# EAGLE design light_switch_hi_volt (EAGLE 7.2.0)
CNAME: Light controller; CREVISION: 1.2; DESIGNER: iGrowing
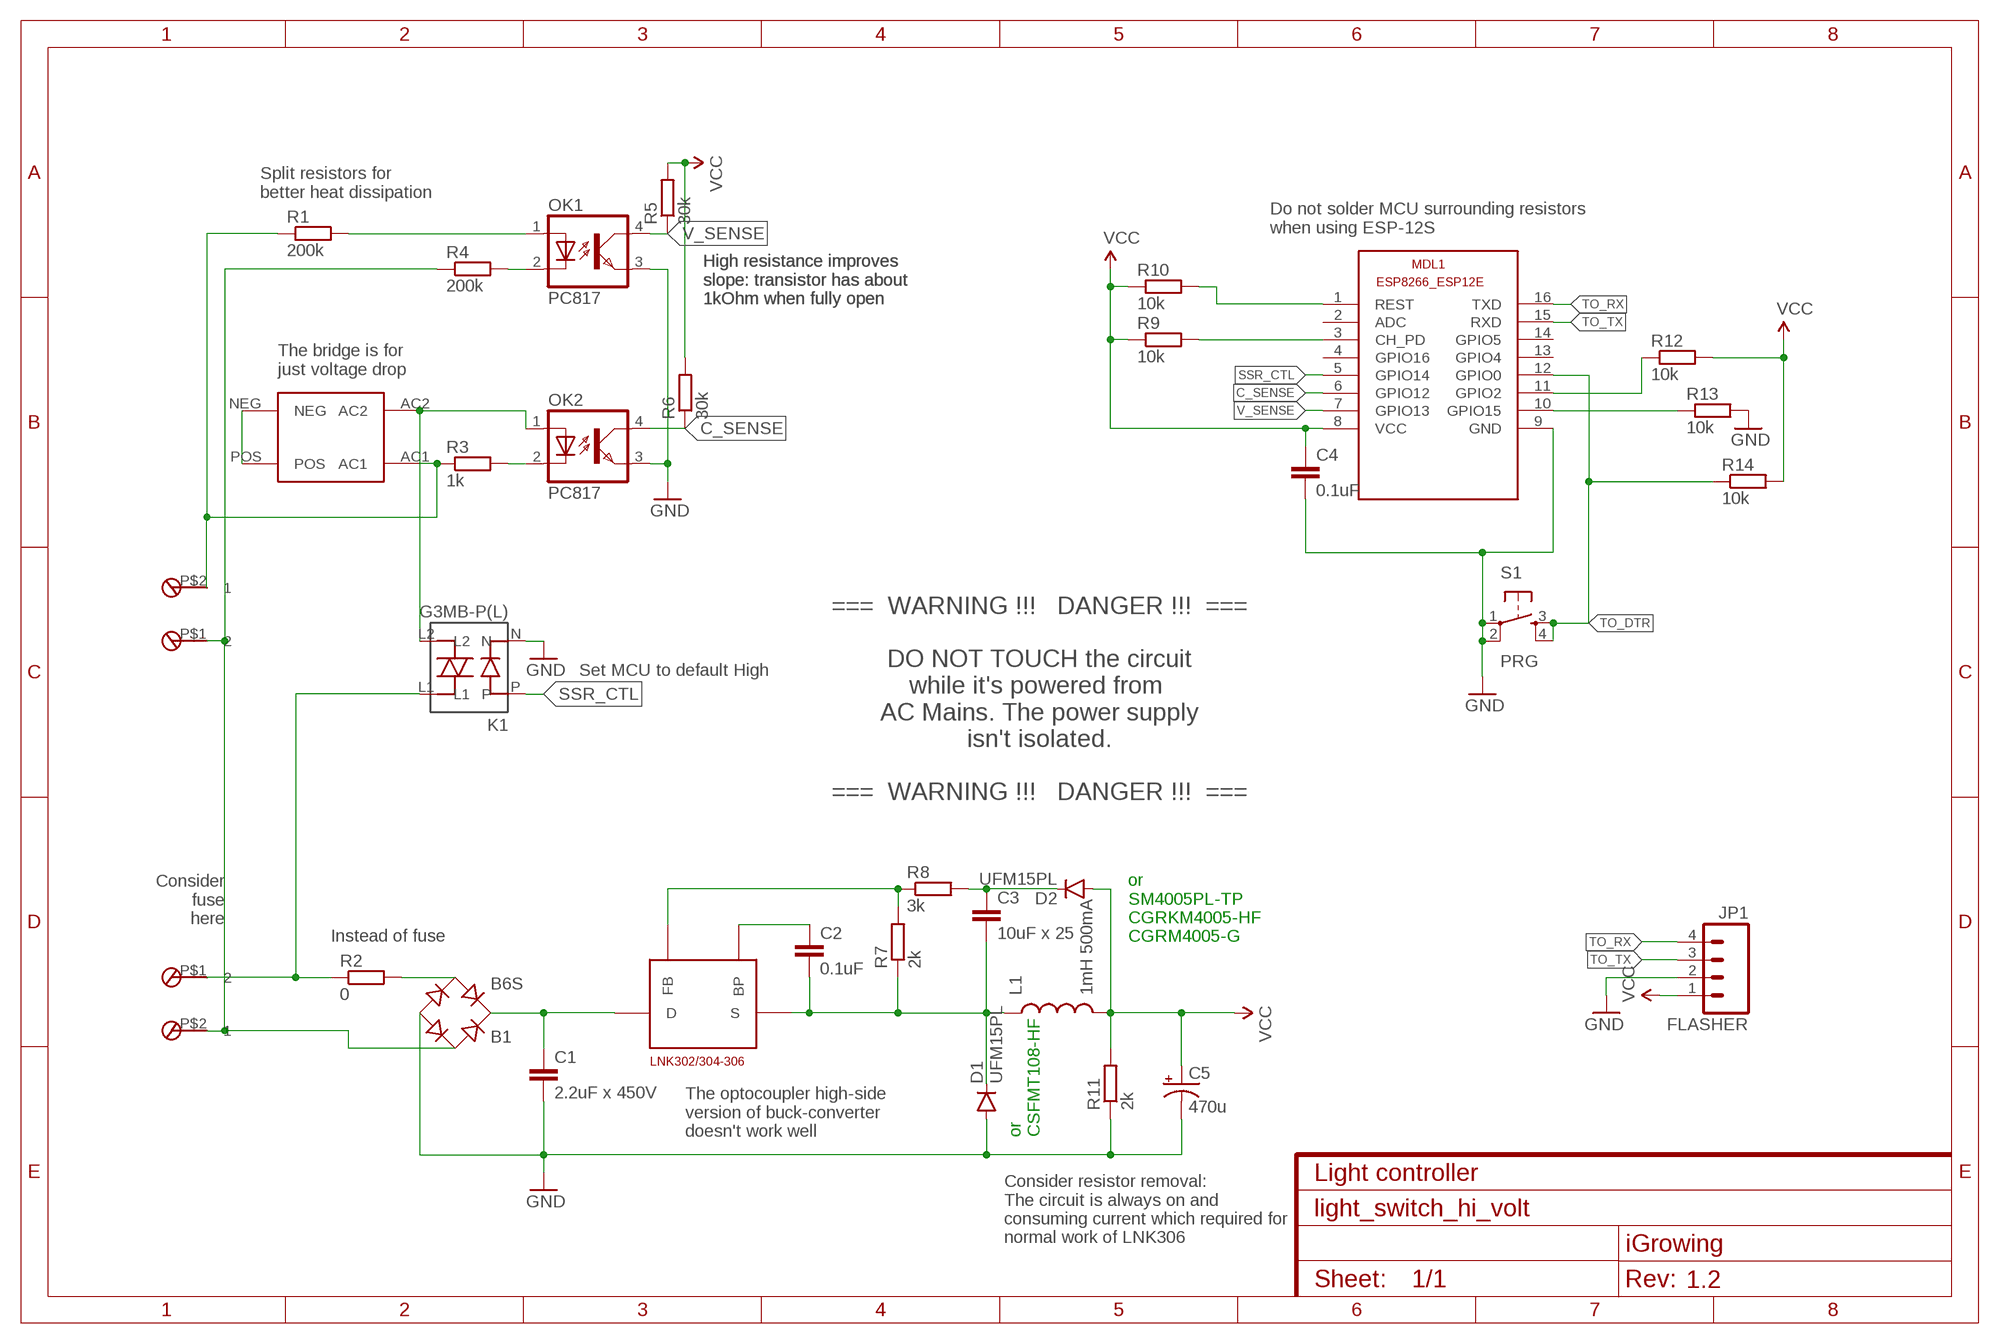
[diagram p0: schematic, sheet 1]

## Parts
B1  B6S  [MBS]
C1  2.2uF x 450V  C-EUC2220K  [C2220K]
C2  0.1uF  CAP0805  [0805]
C3  10uF x 25  CAP0805  [0805]
C4  0.1uF  CAP0805  [0805]
C5  470u  CAP_POL7343  [EIA7343]
D1  UFM15PL  DIODESOD123  [SOD-123]
D2  UFM15PL  DIODESOD123  [SOD-123]
J1  2POS_TERM_BLK_10A_3.5MM  [2POS_TERM_BLK_10A_3.5MM]
J2  2POS_TERM_BLK_10A_3.5MM  [2POS_TERM_BLK_10A_3.5MM]
JP1  FLASHER  M04PTH  [1X04]
K1  G3MB-P(L)  G3MB  [GB3M_SSR]
L1  1mH 500mA  INDUCTORPWR  [CDRH125]
MDL1  ESP8266-12EESP8266-ESP12E  [ESP8266-ESP12E]
OK1  PC817  LTV816S  [SMD4]
OK2  PC817  LTV816S  [SMD4]
R1  200k  R-EU_R0805  [R0805]
R2  0  R-EU_R0603  [R0603]
R3  1k  R-EU_R0603  [R0603]
R4  200k  R-EU_R0805  [R0805]
R5  30k  R-EU_R0603  [R0603]
R6  30k  R-EU_R0603  [R0603]
R7  2k  R-EU_R0603  [R0603]
R8  3k  R-EU_R0603  [R0603]
R9  10k  R-EU_R0603  [R0603]
R10  10k  R-EU_R0603  [R0603]
R11  2k  R-EU_R0603  [R0603]
R12  10k  R-EU_R0603  [R0603]
R13  10k  R-EU_R0603  [R0603]
R14  10k  R-EU_R0603  [R0603]
S1  PRG  TAC_SWITCHSMD  [TACTILE-SWITCH-SMD]
U1  Z4DGP406L-HF  [Z4DGP406L-HF]
U2  LNK306  [SO08]

## Nets
C_SENSE: MDL1.6(GPIO12) OK2.4(COL) R6.1
GND: B1.- C1.2 C4.2 C5.C(-) D1.A JP1.2 K1.N MDL1.9(GND) OK1.3(EMIT) OK2.3(EMIT) R11.1 R13.2 S1.1 S1.2
IO2: MDL1.11(GPIO2) R12.1
IO15: MDL1.10(GPIO15) R13.1
N$1: B1.+ C1.1 U2.4(D)
N$2: J2.P$1 K1.L1 R2.1
N$3: OK1.1(A) R1.2
N$4: B1.AC1 J1.P$1 J2.P$2 R4.1
N$5: U1.NEG U1.POS
N$6: B1.AC2 R2.2
N$7: K1.L2 OK2.1(A) U1.AC2
N$8: J1.P$2 R1.1 R3.1 U1.AC1
N$9: OK2.2(C) R3.2
N$10: OK1.2(C) R4.2
N$15: MDL1.3(CH_PD) R9.2
N$30: C2.1 U2.1(BP)
N$31: C2.2 C3.2 D1.C L1.1 R7.1 U2.5(S) U2.6(S) U2.7(S) U2.8(S)
N$32: R7.2 R8.1 U2.2(FB)
N$33: C3.1 D2.C R8.2
SSR_CTL: K1.P MDL1.5(GPIO14)
TO_DTR: MDL1.12(GPIO0) R14.1 S1.3 S1.4
TO_RTS: MDL1.1(REST) R10.2
TO_RX: JP1.4 MDL1.16(TXD)
TO_TX: JP1.3 MDL1.15(RXD)
V_SENSE: MDL1.7(GPIO13) OK1.4(COL) R5.1
VCC: C4.1 C5.A(+) D2.A JP1.1 L1.2 MDL1.8(VCC) R5.2 R6.2 R9.1 R10.1 R11.2 R12.2 R14.2
Unconnected: MDL1.2(ADC) MDL1.4(GPIO16) MDL1.13(GPIO4) MDL1.14(GPIO5)

## Notes on the sheet
- Split resistors for
  better heat dissipation
- Do not solder MCU surrounding resistors
  when using ESP-12S
- High resistance improves
  slope: transistor has about
  1kOhm when fully open
- High resistance improves
  slope: transistor has about
  1kOhm when fully open
- The bridge is for
  just voltage drop
- Set MCU to default High
- ===  WARNING !!!   DANGER !!!  ===
  
  DO NOT TOUCH the circuit
  while it's powered from 
  AC Mains. The power supply
  isn't isolated.
  
  ===  WARNING !!!   DANGER !!!  ===
- Consider
  fuse
  here
- Instead of fuse
- or
  SM4005PL-TP
  CGRKM4005-HF
  CGRM4005-G
- The optocoupler high-side
  version of buck-converter
  doesn't work well
- or
  CSFMT108-HF
- Consider resistor removal:
  The circuit is always on and
  consuming current which required for
  normal work of LNK306

## Library data of the parts
B1 = rectifier:B*S: Surface Mount Glass Passivated Bridge Rectifiers Source: Comchip Bridge Rectifiers B05S-G_B10S-G.pdf
C1 = rcl:C-EU: CAPACITOR, European symbol; MPN: CKG57NX7T2W225M500JH; OC_NEWARK: 53W0109
C2 C4 = SparkFun-Capacitors:CAP: Capacitor Standard 0603 ceramic capacitor, and 0.1" leaded capacitor.; MF: Taiyo Yuden (U.S.A.), Inc.; MPN: TMK107BJ104KA-T; OC_NEWARK: 86H5300
C3 = SparkFun-Passives:CAP: Capacitor Standard 0603 ceramic capacitor, and 0.1" leaded capacitor.; MPN: GRM219R61E106KA12D; OC_NEWARK: 68X2791
C5 = SparkFun-Capacitors:CAP_POL: Capacitor Polarized These are standard SMD and PTH capacitors. Normally 10uF, 47uF, and 100uF in electrolytic and tantalum varieties. Always verify the external diameter of the through hole cap, it varies with capacity, voltage, and manufacturer. The EIA devices should be standard.
D1 D2 = SparkFun-DiscreteSemi:DIODE: Diode These are standard reverse protection diodes and small signal diodes. SMA package can handle up to about 1A. SOD-323 can handle about 200mA. What the SOD-323 package when ordering, there are some mfgs out there that are 5-pin packages.; MPN: UFM15PL-TP; OC_NEWARK: 69R6525
J1 J2 = bismart:2POS_TERM_BLK_10A_3.5MM; OC_NEWARK: unknown
JP1 = SparkFun-Connectors:M04: Header 4 Standard 4-pin 0.1" header. Use with straight break away headers (SKU : PRT-00116), right angle break away headers (PRT-00553), swiss pins (PRT-00743), machine pins (PRT-00117), and female headers (PRT-00115). Molex polarized connector foot print use with SKU : PRT-08231 with associated crimp pins and housings. 1MM SMD Version SKU: PRT-10208
K1 = bismart:G3MB: Omron G3MB SSR. G3MB-202P 5V control. Up to 240VAC 2A controlled.
L1 = SparkFun-Passives:INDUCTOR: Inductors Basic Inductor/Choke - 0603 and 1206. Footprints are not proven and vary greatly between part numbers. SRN6045- 33uH, 20% 1.4A SDR0403-560KL - 56uH, 10%, 500mA RMS/740mA peak; MPN: 46105C; OC_NEWARK: 12N1335
MDL1 = ESP8266-ESP12E:ESP8266-12E: ESP8266-12E with additional I/O and GPIO04/05 corrected The author cannot warrant that this library is free from error or will meet your specific requirements. Created by PuceBaboon.com. Komagane, Nagano, JAPAN
OK1 OK2 = optocoupler:LTV816: OPTO COUPLER Source: LITEON, LTV816.pdf; OC_FARNELL: unknown; OC_NEWARK: unknown
R1-R8 R11 = resistor:R-EU_: RESISTOR, European symbol; MF: VISHAY/DALE; MPN: CRCW06032K00FKEA; OC_NEWARK: 52K8223
R9 R10 R12-R14 = rcl:R-EU_: RESISTOR, European symbol
S1 = SparkFun-Retired:TAC_SWITCH: Momentary Switch Button commonly used for reset or general input. Spark Fun Electronics SKU : COM-00097 SMT- SWCH-08247; PROD_ID: SWCH-08247; VALUE: TAC_SWITCHSMD
U1 = bismart:Z4DGP406L-HF; OC_NEWARK: unknown
U2 = bismart:LNK30: Lowest Component Count, Energy-Efficient Off-Line Switcher IC LNK302, LNK304, LNK305, LKN306 Product Highlights Cost Effective Linear/Cap Dropper Replacement; MPN: LNK306GN; OC_FRANELL: 1448228; OC_NEWARK: unknown; PACKAGE: SMD-8; SUPPLIER: POWER INTEGRATIONS

## Board
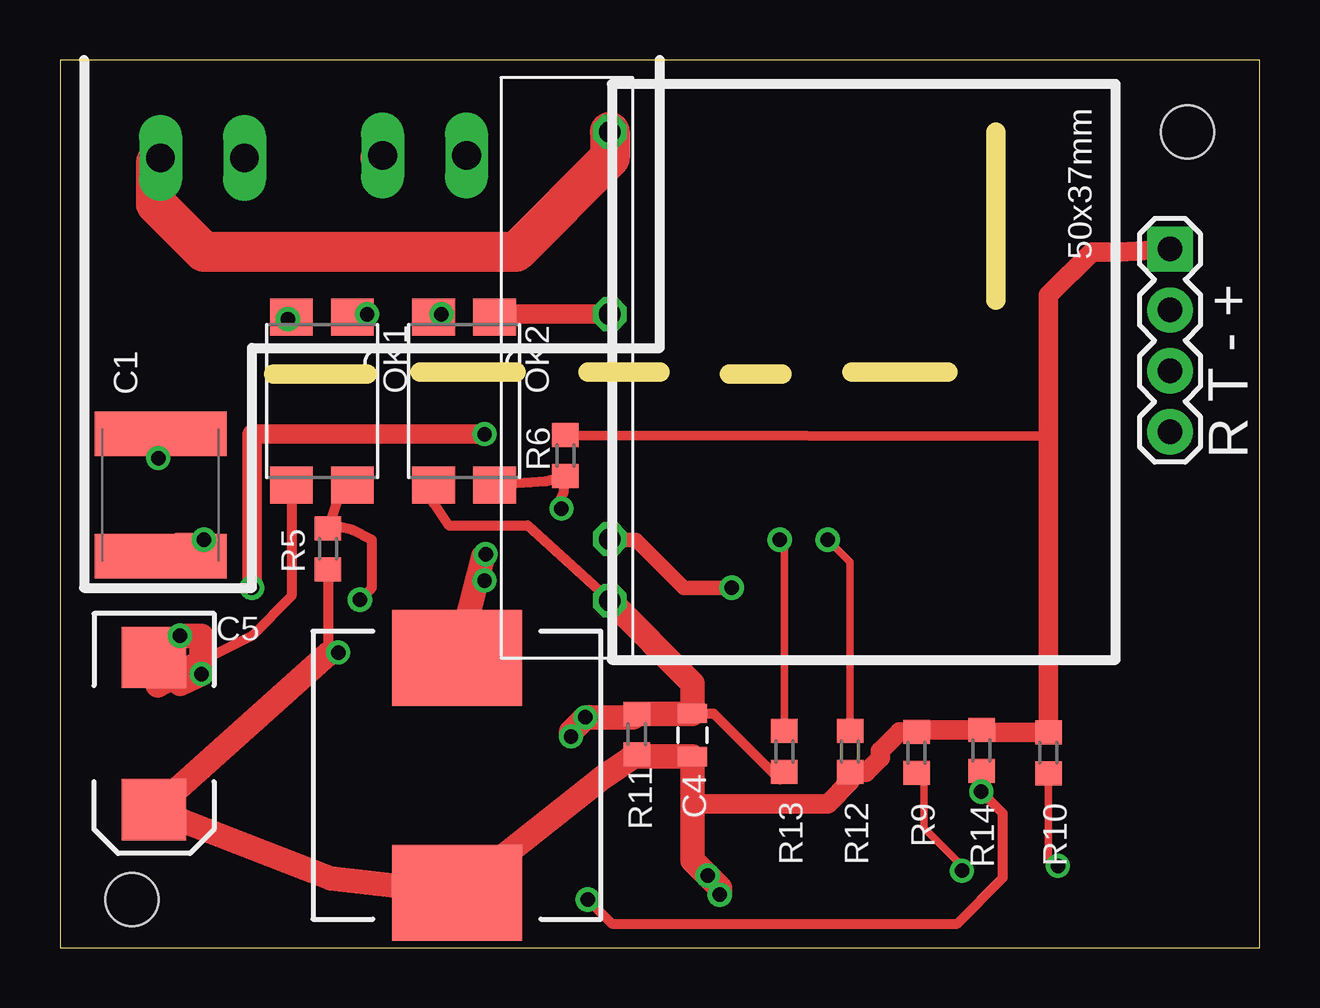
[diagram p1: board, top side]
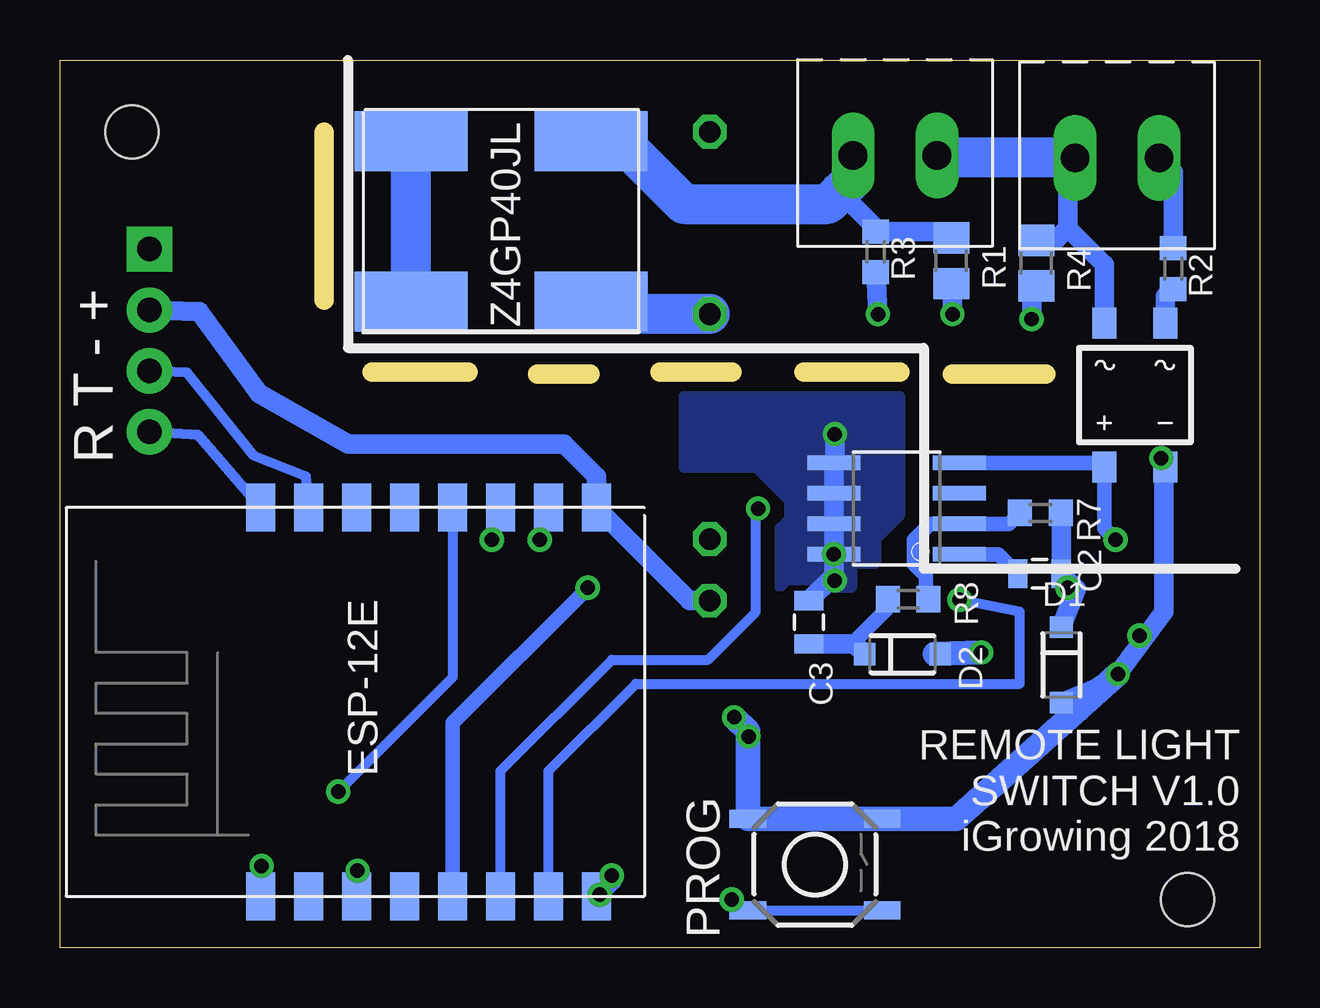
[diagram p2: board, bottom side, seen from below]

Size 50 x 37 mm. Coordinates in mm from the lower left corner, seen from the top.
Outline: 0,0 50,0 50,37 0,37 0,0
Copper layers (1*16): Top 0.035mm / dielectric 1.5mm / Bottom 0.035mm
Design rules "default *": minimum track width 10mil, minimum drill 20mil, track to track 8mil, track to pad 8mil, pad to pad 8mil, via to via 8mil, smd to smd 8mil, copper to edge 40mil, drill to drill 8mil, minimum pad ring 10mil, minimum via ring 8mil, stop-mask expansion 4mil, vias tented up to drill 25mil, thermal gap 10mil
Holes 2.2 mm at 47,34 3,2
Milling: 6 lines

### Footprints (pad centres in the part's own frame; a part is rotated, then mirrored left to right if it is on the bottom)
MBS = smd 1 x 1.3: + -1.27,-3; - 1.27,-3; AC1 -1.27,3; AC2 1.27,3
C2220K = smd 1.85 x 5.5: 1 -2.55,0; 2 2.55,0
0805 = smd 0.8 x 1.2: 1 -0.9,0; 2 0.9,0
EIA7343 = smd 2.55 x 2.7: A 3.17,0; C -3.17,0
SOD-123 = smd 0.9 x 0.95: A 1.575,0; C -1.575,0
2POS_TERM_BLK_10A_3.5MM = drill 1.2 long: P$1 0,2; P$2 0,-1.5
1X04 = drill 1.016 pad 1.88 square: 1 0,0 | drill 1.016 pad 1.88: 2 2.54,0; 3 5.08,0; 4 7.62,0
GB3M_SSR = drill 0.9 octagon: L1 15.928,-2.54; L2 8.328,-2.54; N -3.619,-2.54; P -1.052,-2.54
CDRH125 = smd 5.4 x 4: 1 0,4.9; 2 0,-4.9
ESP8266-ESP12E = smd 2 x 1.2: 1 0,16; 2 0,14; 3 0,12; 4 0,10; 5 0,8; 6 0,6; 7 0,4; 8 0,2; 9 16.2,2; 10 16.2,4; 11 16.2,6; 12 16.2,8; 13 16.2,10; 14 16.2,12; 15 16.2,14; 16 16.2,16
SMD4 = smd 1.78 x 1.55: 1 -1.27,-3.5; 2 1.27,-3.5; 3 1.27,3.5; 4 -1.27,3.5
R0805 = smd 1.3 x 1.5: 1 -0.95,0; 2 0.95,0
R0603 = smd 1 x 1.1: 1 -0.85,0; 2 0.85,0
TACTILE-SWITCH-SMD = smd 1.524 x 0.762: 1 -2.794,1.905; 2 2.794,1.905; 3 -2.794,-1.905; 4 2.794,-1.905
Z4DGP406L-HF = smd 2.5 x 4.7: AC1 1.3,-2; AC2 8,-2; NEG 8,-9.5; POS 1.3,-9.5
SO08 = smd 0.61 x 2.21: 1 -1.905,-2.616; 2 -0.635,-2.616; 3 0.635,-2.616; 4 1.905,-2.616; 5 1.905,2.616; 6 0.635,2.616; 7 -0.635,2.616; 8 -1.905,2.616

### Placement (x,y rotation side)
B1  5.19,23.03 0 bottom
C1  4.19,18.86 90 top
C2  9.17,15.58 0 bottom
C3  18.78,13.56 90 bottom
C4  26.37,8.86 90 top
C5  3.92,8.92 270 top
D1  8.26,11.78 270 bottom
D2  14.88,12.23 0 bottom
J1  15.45,33.02 270 bottom
J2  6.19,32.92 270 bottom
JP1  46.27,29.12 270 top
K1  20.38,18.08 90 top
L1  16.55,7.18 0 top
MDL1  25.64,2.14 90 bottom
OK1  10.92,22.78 180 top
OK2  16.84,22.78 180 top
R1  12.85,28.63 270 bottom
R2  3.6,28.3 270 bottom
R3  30R  [R0603]  16,29 270 bottom
R4  9.31,28.53 270 bottom
R5  11.17,16.62 270 top
R6  21.07,20.51 90 top
R7  9.14,18.12 180 bottom
R8  14.65,14.52 180 bottom
R9  35.7,8.13 270 top
R10  41.2,8.12 270 top
R11  24.04,8.9 270 top
R12  32.93,8.18 270 top
R13  30.19,8.18 270 top
R14  38.41,8.22 90 top
S1  18.53,3.46 0 bottom
U1  25.87,34.92 270 bottom
U2  15.13,18.3 90 bottom

### Tracks (layer width: path | path; a pad name or v marks a point on that pad's centre or on a via)
C_SENSE  (via drill 0.6)
  Top 0.406: OK2.4 20.26,19.43 R6.1 21,19.17 21,19 20.7,18.3 v20.9,18.3
  Bottom 0.406: MDL1.6 31.64,7.36 27,12 23,12 21,14 21,18.2 v20.9,18.3
GND  (via drill 0.6)
  Top 0.406: C4.2 27.24,9.76 30,7 30,7.14 R13.2 | OK1.3 9.65,14.65 8,13 6,12 | OK2.3 15.57,18.53 16.2,17.6 19.48,17.6 K1.N
  Top 0.61: v4.1,20.4 4.1,21.32 C1.2
  Top 0.813: C4.2 | C5.C 4.08,10.92 | 6,12 5,11 | 23.89,9.6 R11.1
  Top 1.016: C4.2 26.37,11.01 K1.N | R11.1 C4.2 | 4.08,10.92 6,12 | 5,11 v5.9,11.4 5.9,13 v5,13 | 23.89,9.6 v21.9,9.6 21.3,9 v21.3,8.8
  Bottom 0.61: B1.- 3.92,20.22 v4.1,20.4
  Bottom 0.813: K1.N 23.76,14.46 MDL1.9 27.64,19.64 29,21 38,21 41.7,23.1 44.2,26.51 JP1.2 | S1.1 S1.2 | B1.- 4,19.95 4,14 v5.9,11.4 6.79,10.79 D1.A
  Bottom 1.016: v5.9,11.4 12.63,5.37 S1.1 21.32,9.02 v21.9,9.6
  pour Top (isolate 40): 0,17 0,8 8,0 42,0 42,23 25,23 25,19 22,19 22,14 6,14 3,14
  pour Bottom (isolate 40): 1,16 13,21 13,18 19,12 20,12 22,14 22,19 25,19 25,23 42,23 42,0 8,0 1,7
IO2  (via drill 0.6)
  Top 0.305: R12.1 32.93,16.07 v32,17
  Bottom 0.305: v32,17 32,17.98 MDL1.11
IO15  (via drill 0.6)
  Top 0.305: R13.1 30.19,16.81 v30,17
  Bottom 0.305: v30,17 30,17.98 MDL1.10
N$1  (via drill 0.6)
  Top 0.61: v6,17 4.88,17 C1.1
  Bottom 0.61: v6,17 6.46,17.46 B1.+ 6.63,20.2 U2.4
N$2
  Top 1.676: K1.L1 22.92,32.92 19,29 6,29 4,31 4,32.73 J2.P$1
  Bottom 0.813: R2.1 3.6,32.33 J2.P$1
N$3  (via drill 0.6)
  Top 0.813: OK1.1 12.68,26.28 v12.8,26.4
  Bottom 0.813: v12.8,26.4 12.8,27.63 R1.2
N$4  (via drill 0.6)
  Top 1.676: v13.35,32.92 J1.P$1
  Bottom 0.813: B1.AC1 6.46,28.46 8,30 | 8,30 8,32.61 J2.P$2 | R4.1 8.52,29.48 8,30
  Bottom 1.676: J2.P$2 v13.35,32.92
N$5
  Bottom 1.676: U1.NEG U1.POS
N$6
  Bottom 0.813: B1.AC2 3.92,27.13 R2.2
N$7
  Top 0.813: K1.L2 18.24,26.41 OK2.1
  Bottom 1.676: K1.L2 27.36,26.41 U1.AC2
N$8
  Bottom 0.813: R1.1 13.12,29.85 R3.1 16,30 17.5,31.5
  Bottom 1.676: U1.AC1 26.62,33.62 24,31 18,31 17.5,31.5 17,32 17,32.97 J1.P$2
N$9  (via drill 0.6)
  Top 0.813: OK2.2 15.57,26.57 v15.9,26.4
  Bottom 0.813: v15.9,26.4 R3.2
N$10  (via drill 0.6)
  Top 0.813: OK1.2 9.58,26.28 v9.5,26.2
  Bottom 0.813: v9.5,26.2 9.5,27.39 R4.2
N$15  (via drill 0.6)
  Top 0.305: v37.6,3.2 37.6,3.4 36,5 36,6.98 R9.2
  Bottom 0.305: MDL1.3 37.64,3.16 v37.6,3.2
N$30
  Bottom 0.61: U2.1 10.88,16.39 C2.1
N$31  (via drill 0.6)
  Top 0.813: 17.63,16.28 U2.8 | v8,15 8,21.4 v17.7,21.4
  Top 1.016: L1.1 17.63,16.28
  Bottom 0.813: C3.2 17.75,15.49 U2.8 U2.7 U2.6 U2.5 17.7,20.25 v17.7,21.4 | D1.C 7.64,14.96 C2.2 | C2.2 8.27,18.1 R7.1 | C2.2 8.27,15.27 v8,15
  other vias: 17.75,16.39 17.7,15.3
  pour Bottom (no thermals): 15,23 15,18 16,17 16,16 17,16 17,15 17.7,15 18,15.3 19.7,15.3 20,15 20,17.5 19.6,17.9 19.6,18.6 21,20 24,20 24,23
N$32
  Bottom 0.61: R7.2 10.45,17.66 U2.2 13.73,17.66 14.4,17 14.4,16 13.9,15.5 13.9,14.92 R8.1
N$33
  Bottom 0.61: R8.2 15.5,14.16 17,12.66
  Bottom 0.813: C3.1 17,12.66 16.89,12.66 D2.C
SSR_CTL  (via drill 0.6)
  Top 0.61: v28,15 26,15 24,17 22.95,17 K1.P
  Bottom 0.61: MDL1.5 33.64,9.36 v28,15
TO_DTR  (via drill 0.6)
  Top 0.406: R14.1 v38.4,6.5 39.3,5.6 39.3,2.9 37.4,1 23,1 v22,2
  Bottom 0.406: S1.4 S1.3 21.55,1.55 v22,2 | MDL1.12 33.64,11.26 v38.4,6.5
TO_RTS  (via drill 0.6)
  Top 0.305: R10.2 41.2,3.8 v41.6,3.4
  Bottom 0.305: v41.6,3.4 41.6,2.18 MDL1.1
TO_RX
  Bottom 0.406: MDL1.16 44.24,21.37 JP1.4
TO_TX
  Bottom 0.406: MDL1.15 39.74,19.64 41.9,20.5 44.7,23.97 JP1.3
V_SENSE  (via drill 0.6)
  Top 0.406: OK1.4 11.57,18.66 R5.1 11.4,17.6 12.2,17.4 13,17 13,15 v12.5,14.5
  Bottom 0.406: MDL1.7 29.64,7.36 26,11 10,11 10,14 v12.5,14.5
VCC  (via drill 0.6)
  Top 0.406: R5.2 11.17,12.24 | R6.2 41.27,21.33 41.2,20
  Top 0.813: 24.13,7.96 R11.2 | 26.37,6 32,6 32.93,6.93 R12.2 32.96,7.3 33.6,7.3 34.2,7.9 34.2,8.2 34.98,8.98 R9.1 35.79,9.07 R14.2 38.51,8.97 R10.1 41.2,20 41.2,27.2 43,29 44.15,29 JP1.1 | v11.6,12.3 11.63,12.3 11.17,12.24
  Top 1.016: 11.17,12.24 C5.A 11.29,2.88 L1.2 22.58,7.05 R11.2 | 24.13,7.96 C4.1 26.37,6 26.37,3.63 v27,3 27.5,2.5 v27.5,2.2
  Bottom 0.813: v27,3 27,2.78 MDL1.8 | D2.A 13.53,12.23
  Bottom 1.016: 13.53,12.23 v11.6,12.3

### Text on the board
tPlace: 50x37mm | R T - +
bPlace: R T - + | REMOTE LIGHT / SWITCH V1.0 / iGrowing 2018 | PROG